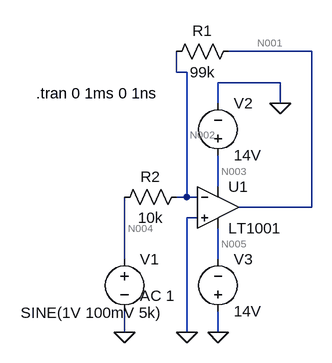
[diagram p0: schematic Draft3.asc]
Draft3.asc, the LTspice schematic file:
Version 4
SHEET 1 880 680
WIRE 320 -48 192 -48
WIRE 112 -16 112 -48
WIRE 128 -16 112 -16
WIRE 272 0 176 0
WIRE 176 32 176 0
WIRE 272 32 272 0
WIRE 176 160 176 112
WIRE 128 176 128 -16
WIRE 128 176 112 176
WIRE 144 176 128 176
WIRE 320 192 320 -48
WIRE 320 192 208 192
WIRE 144 208 128 208
WIRE 32 272 32 176
WIRE 176 272 176 224
WIRE 32 384 32 352
WIRE 128 384 128 208
WIRE 176 384 176 352
FLAG 272 32 0
FLAG 176 384 0
FLAG 32 384 0
FLAG 128 384 0
SYMBOL Opamps\\LT1001 176 128 R0
SYMATTR InstName U1
SYMBOL voltage 32 256 R0
WINDOW 3 -160 98 Left 2
WINDOW 123 24 72 Left 2
WINDOW 39 0 0 Left 2
SYMATTR Value SINE(1V 100mV 5k)
SYMATTR Value2 AC 1
SYMATTR SpiceLine ""
SYMATTR InstName V1
SYMBOL voltage 176 128 M180
WINDOW 0 24 96 Left 2
WINDOW 3 24 16 Left 2
WINDOW 123 0 0 Left 2
WINDOW 39 0 0 Left 2
SYMATTR InstName V2
SYMATTR Value 14V
SYMATTR Value2 ""
SYMATTR SpiceLine ""
SYMBOL voltage 176 368 M180
WINDOW 0 24 96 Left 2
WINDOW 3 24 16 Left 2
WINDOW 123 0 0 Left 2
WINDOW 39 0 0 Left 2
SYMATTR InstName V3
SYMATTR Value 14V
SYMATTR Value2 ""
SYMATTR SpiceLine ""
SYMBOL res 208 -64 R90
WINDOW 0 0 56 VBottom 2
WINDOW 3 32 56 VTop 2
SYMATTR InstName R1
SYMATTR Value 99k
SYMATTR SpiceLine tol=10
SYMBOL res 16 192 R270
WINDOW 0 32 56 VTop 2
WINDOW 3 0 56 VBottom 2
SYMATTR InstName R2
SYMATTR Value 10k
SYMATTR SpiceLine tol=10
TEXT -104 16 Left 2 !.tran 0 1ms 0 1ns

The netlist it stands for:
* Draft3.asc
XU1 0 N002 N003 N005 N001 LT1001  ; pins In+ In- V+ V- OUT
V1 N004 0 SINE(1V 100mV 5k) AC 1
V2 N003 0 14V
V3 0 N005 14V
R1 N001 N002 99k tol=10
R2 N004 N002 10k tol=10
.tran 0 1ms 0 1ns
.lib LTC.lib
.backanno
.end

* Results of the author's LTspice run, read from the files saved beside the schematic
* Operating Point, zero values left out:
*   V(n002) = 13.27 µV
*   V(n003) = 14 V
*   V(n005) = -14 V
*   V(n001) = -9.9 V
*   V(n004) = 1 V
*   I(R2) = 100 µA
*   I(R1) = -100 µA
*   I(V3) = -2.3 mA
*   I(V2) = -2.2 mA
*   I(V1) = -100 µA
*   Ix(u1:3) = 2.2 mA
*   Ix(u1:4) = -2.3 mA
*   Ix(u1:5) = 100 µA
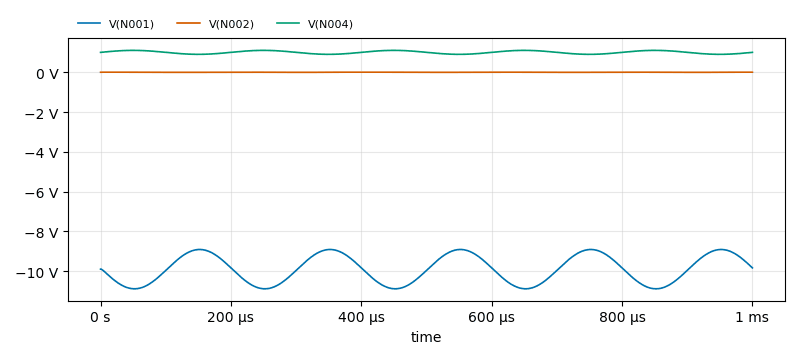
[diagram p1: Transient Analysis of Draft3.asc, plotted from the saved traces]
* Transient Analysis, 1 run:
*   V(N001): min -10.89 V, max -8.912 V, average -9.9 V, rms 9.925 V, last -9.836 V
*   V(N002): min -5.813 mV, max 5.84 mV, average 2.28 µV, rms 4.103 mV, last 5.83 mV
*   V(N004): min 900 mV, max 1.1 V, average 1 V, rms 1.002 V, last 1 V